# Altium schematic sheet currSens_sigCond.SchDoc
size A4; SheetNumber: 1; SheetTotal: 4; SPICEModelCacheTGBYDHUA: <root> / <DocumentId>TGBYDHUA</DocumentId> / </root>
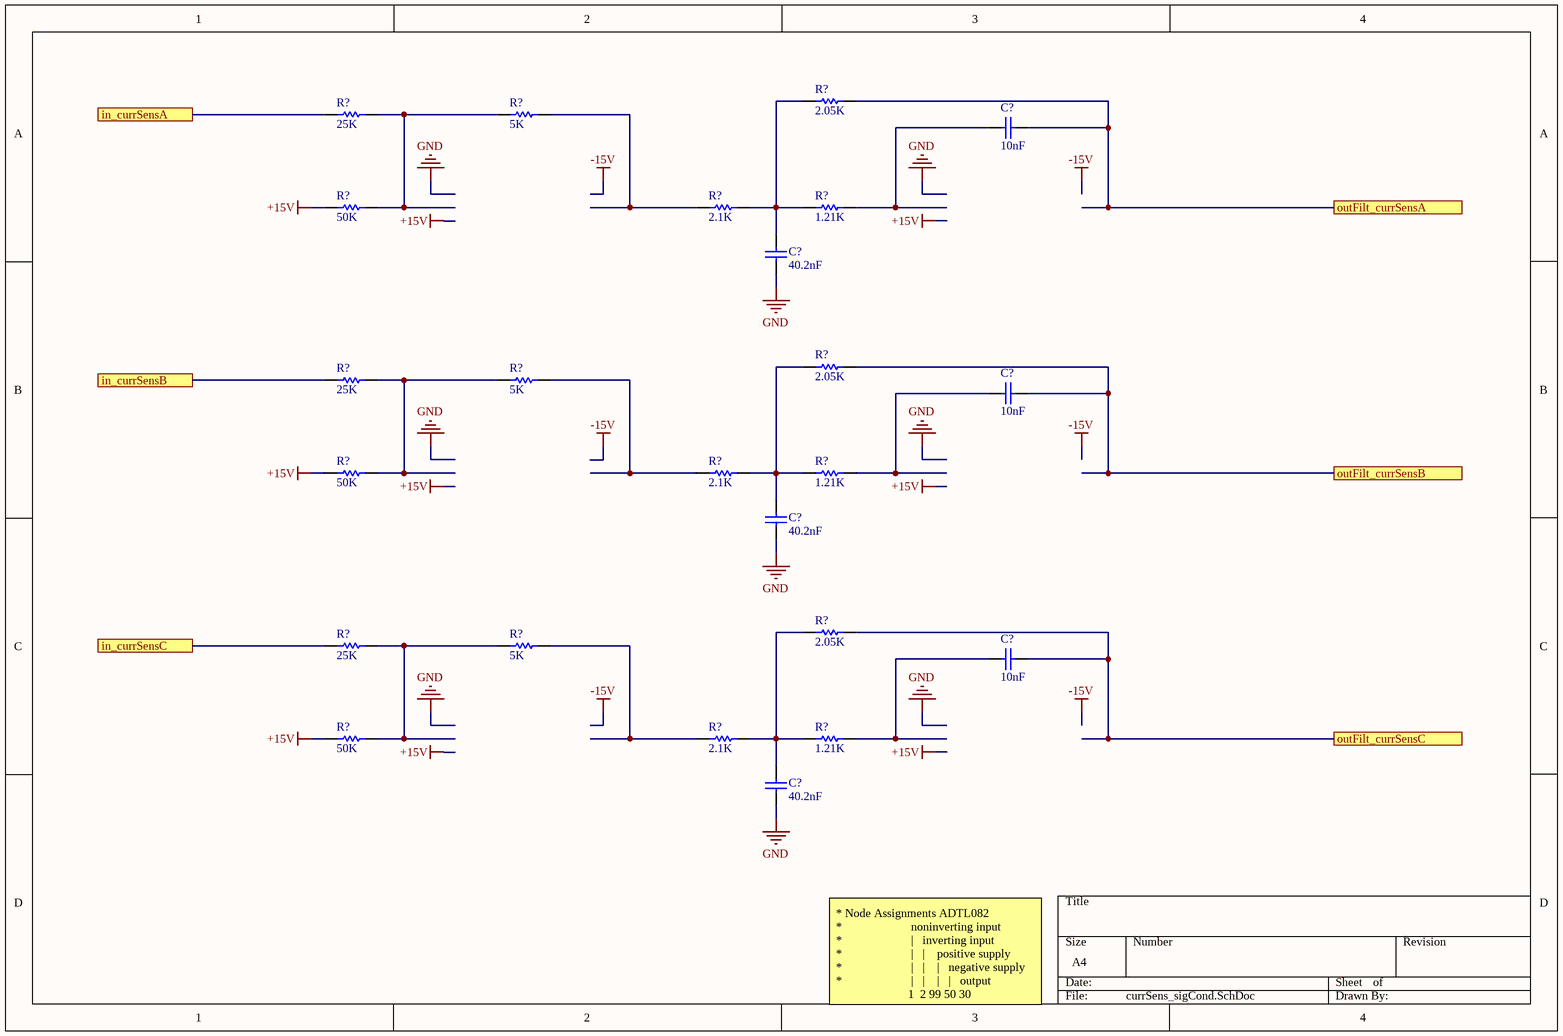
[diagram p0: currSens_sigCond.SchDoc]

## Parts
(Parts that share a designator on the sheet are numbered #1, #2 ... from top to bottom, then left to right.)
C?#1  value 10nF  (hidden comment: Capacitor)
C?#2  value 40.2nF  (hidden comment: Capacitor)
C?#3  value 10nF  (hidden comment: Capacitor)
C?#4  value 40.2nF  (hidden comment: Capacitor)
C?#5  value 10nF  (hidden comment: Capacitor)
C?#6  value 40.2nF  (hidden comment: Capacitor)
R?#1  value 2.05K  (hidden comment: Resistor)
R?#2  value 25K  (hidden comment: Resistor)
R?#3  value 5K  (hidden comment: Resistor)
R?#4  value 50K  (hidden comment: Resistor)
R?#5  value 2.1K  (hidden comment: Resistor)
R?#6  value 1.21K  (hidden comment: Resistor)
R?#7  value 2.05K  (hidden comment: Resistor)
R?#8  value 25K  (hidden comment: Resistor)
R?#9  value 5K  (hidden comment: Resistor)
R?#10  value 50K  (hidden comment: Resistor)
R?#11  value 2.1K  (hidden comment: Resistor)
R?#12  value 1.21K  (hidden comment: Resistor)
R?#13  value 2.05K  (hidden comment: Resistor)
R?#14  value 25K  (hidden comment: Resistor)
R?#15  value 5K  (hidden comment: Resistor)
R?#16  value 50K  (hidden comment: Resistor)
R?#17  value 2.1K  (hidden comment: Resistor)
R?#18  value 1.21K  (hidden comment: Resistor)

## Ports
in_currSensA, in_currSensB, in_currSensC, outFilt_currSensA, outFilt_currSensB, outFilt_currSensC

## Nets
+15V: R?#4.1 R?#10.1 R?#16.1
GND: C?#2.1 C?#4.1 C?#6.1
in_currSensA: R?#2.1 ; port in_currSensA
in_currSensB: R?#8.1 ; port in_currSensB
in_currSensC: R?#14.1 ; port in_currSensC
outFilt_currSensA: C?#1.2 R?#1.2 ; port outFilt_currSensA
outFilt_currSensB: C?#3.2 R?#7.2 ; port outFilt_currSensB
outFilt_currSensC: C?#5.2 R?#13.2 ; port outFilt_currSensC
NetC?#1_1: C?#1.1 R?#6.2
NetC?#2_2: C?#2.2 R?#1.1 R?#5.2 R?#6.1
NetC?#3_1: C?#3.1 R?#12.2
NetC?#4_2: C?#4.2 R?#7.1 R?#11.2 R?#12.1
NetC?#5_1: C?#5.1 R?#18.2
NetC?#6_2: C?#6.2 R?#13.1 R?#17.2 R?#18.1
NetR?#2_2: R?#2.2 R?#3.1 R?#4.2
NetR?#3_2: R?#3.2 R?#5.1
NetR?#8_2: R?#8.2 R?#9.1 R?#10.2
NetR?#9_2: R?#9.2 R?#11.1
NetR?#14_2: R?#14.2 R?#15.1 R?#16.2
NetR?#15_2: R?#15.2 R?#17.1

## Notes on the sheet
- * Node Assignments ADTL082
  *                       noninverting input
  *                       |   inverting input
  *                       |   |    positive supply
  *                       |   |    |   negative supply
  *                       |   |    |   |   output
  1  2 99 50 30

## Library data of the parts
C?#1-C?#6 = Capacitor: SimulationGenericComponent: True
R?#1-R?#18 = Resistor: TC1: 0; SimulationGenericComponent: True; TC2: 0